# Altium schematic sheet power.SchDoc
size A4; SheetNumber: 4; SheetTotal: 5
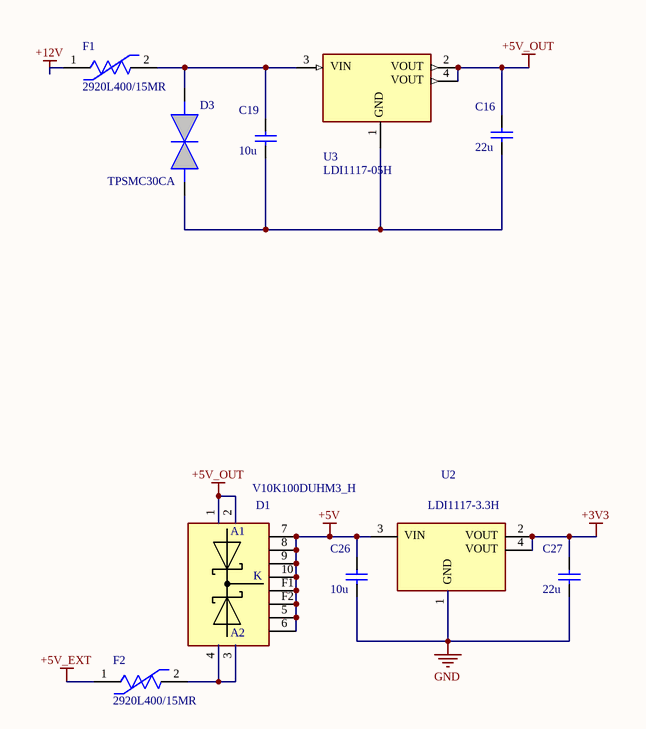
[diagram p0: power.SchDoc]

## Parts
C16  22u  [CAPC1206(3216)150_L]
C19  10u  [CAPC1206(3216)150_L]
C26  10u  [CAPC1206(3216)150_L]
C27  22u  [CAPC1206(3216)150_L]
D1  V10K100DUHM3_H  [V10K100DUHM3H]
D3  TPSMC30CA  [TPSMC30CA]
F1  2920L400/15MR  [FP-2920L400-15MR-MFG]
F2  2920L400/15MR  [FP-2920L400-15MR-MFG]
U2  LDI1117-3.3H  [LDI1117-3.3H]
U3  LDI1117-05H  [LDI1117-05H]

## Nets
+3V3: C27.1 U2.2 U2.4
+5V: C26.1 D1.5 D1.6 D1.7 D1.8 D1.9 D1.10 D1.F1 D1.F2 U2.3
+5V_EXT: F2.1
+5V_OUT: C16.1 D1.1 D1.2 U3.2 U3.4
+12V: F1.1
GND: C26.2 C27.2 U2.1
NetC16_2: C16.2 C19.2 D3.2(A)
NetC19_1: C19.1 D3.1(K) F1.2 U3.3
NetD1_3: D1.3 D1.4 F2.2

Not connected (* = marked no-connect by the designer): U3 1

## Notes on the sheet
- (in symbol LDI1117-3.3H) VIN; VOUT; GND
- (in symbol LDI1117-05H) VIN; VOUT; GND
- (in symbol V10K100DUHM3_H) A1; K; A2

## Library data of the parts
C16 C19 C26 C27 = CMP-1037-04778-1: CAP 1.8uF 10V ±5% 1206 (3216 Metric) Thickness 1.45mm SMD; Case-EIA: 1206; Tolerance: Â±5%; Case-Metric: 3216; Technology: SMT; Value: 1.8uF; Rated Voltage: 10 V; Max Thickness: 1.45 mm
D1 = V10K100DUHM3_H: Schottky Diodes & Rectifiers 10A 100V TMBS FlatPAK 5x6; Manufacturer_Name: Vishay; Manufacturer_Part_Number: V10K100DUHM3/H; Geometry.Height: 1.09mm; Mouser Part Number: 78-V10K100DUHM3/H; Mouser Price/Stock: https://www.mouser.co.uk/ProductDetail/Vishay-General-Semiconductor/V10K100DUHM3-H/?qs=u16ybLDytRayB9owesg4qQ%3D%3D; Arrow Part Number: *; Arrow Price/Stock: *; Datasheet Link: https://www.farnell.com/datasheets/2721061.pdf
D3 = TPSMC30CA: TPSMC Series - Surface Mount, 1500W TVS Diode-AEC-Q101 Qualified, 25.6V, 41.4V, DO-214AB, RoHS; Manufacturer_Name: Vishay; Manufacturer_Part_Number: VS-MBRS340-M3/9AT; Manufacturer: Littelfuse; Geometry.Height: 2.62mm; Breakdown Voltage: 30V; Max Breakdown Voltage: 31.5V; Max Power Dissipation: 6.5W; Max Reverse Leakage Current: 1µA; Max Surge Current: 36.7A; Min Breakdown Voltage: 28.5V; Number of Bidirectional Channels: 1; Peak Pulse Power: 1.5kW; Polarity: Bidirectional; Power Line Protection: No; Test Current: 1mA; Working Voltage: 3.5V; Mouser Part Number: 78-VS-MBRS340-M39AT; Mouser Price/Stock: https://www.mouser.co.uk/ProductDetail/Vishay-Semiconductors/VS-MBRS340-M3-9AT?qs=nc3S1USEIbv1XISTKnRMKw%3D%3D; Arrow Part Number: VS-MBRS340-M3/9AT; Arrow Price/Stock: https://www.arrow.com/en/products/vs-mbrs340-m39at/vishay?region=nac; Datasheet Link: https://componentsearchengine.com/Datasheets/1/VS-MBRS340-M3_9AT.pdf; Supplier: Farnell; Supplier Part Number: 3392487; Manufacturer Part Number: TPSMC30CA; RoHS: Compliant; Category: TVS Diodes; Stock: 2290; Clamping Voltage: 41.4V; Composition: Zener; Height: 2.62mm; Lead Free: Lead Free; Length: 7.11mm; Lifecycle Status: Production; Max Operating Temperature: 150°C; Min Operating Temperature: -65°C; Mounting Technology: Surface Mount; Number of Elements: 1; Number of Terminals: 2; Packaging: Digi-Reel®; Peak Pulse Current: 36.7A; Peak Reverse Current: 1µA; REACH SVHC: No; Reverse Standoff Voltage: 25.6V; Reverse Voltage: 25.6V; Schedule B: 8541100080; Termination: SMD/SMT; Weight: 210.013267mg; Width: 6.22mm; ComponentLink1URL: https://datasheet.octopart.com:443/TPSMC30CA-Littelfuse-datasheet-180609796.pdf?src-supplier=IHS; ComponentLink1Description: https://datasheet.octopart.com:443/TPSMC30CA-Littelfuse-datasheet-180609796.pdf?src-supplier=IHS; ComponentLink2URL: https://datasheet.octopart.com:443/TPSMC30CA-Littelfuse-datasheet-140259240.pdf?src-supplier=Newark; ComponentLink2Description: https://datasheet.octopart.com:443/TPSMC30CA-Littelfuse-datasheet-140259240.pdf?src-supplier=Newark; ComponentLink3URL: https://datasheet.octopart.com:443/TPSMC30CA-Littelfuse-datasheet-104627261.pdf?src-supplier=Littelfuse+SCT; ComponentLink3Description: https://datasheet.octopart.com:443/TPSMC30CA-Littelfuse-datasheet-104627261.pdf?src-supplier=Littelfuse+SCT; ComponentLink4URL: https://datasheet.octopart.com:443/TPSMC30CA-Littelfuse-datasheet-36859614.pdf?src-supplier=Fuses+Unlimited; ComponentLink4Description: https://datasheet.octopart.com:443/TPSMC30CA-Littelfuse-datasheet-36859614.pdf?src-supplier=Fuses+Unlimited; ComponentLink5URL: https://datasheet.octopart.com:443/TPSMC30CA-Littelfuse-datasheet-178249297.pdf?src-supplier=Burklin+Elektronik; ComponentLink5Description: https://datasheet.octopart.com:443/TPSMC30CA-Littelfuse-datasheet-178249297.pdf?src-supplier=Burklin+Elektronik
F1 F2 = CMP-08606-000010-2: PTC RESET FUSE 15V 4A 2920; Max Current Rating: 40A; Time to Trip: 4s; Trip Current: 8A; Approvals: TUV; Min Operating Temperature: -40°C; Packaging: Tape and Reel; Case Code (Metric): 7351; Hold Current: 4A; Max Operating Temperature: 85°C; Case Code (Imperial): 2920; Mount: Surface Mount
U2 = LDI1117-3.3H: Fixed Positive LDO Regulator; Manufacturer: Diotec; Supplier: Mouser; Supplier Part Number: 637-LDI1117-3.3H; Manufacturer Part Number: LDI1117-3.3H; RoHS: No; Category: Voltage Regulators - Linear; Stock: 5056; Pricing: 1=0,4, 10=0,286, 50=0,286, 100=0,199, 1000=0,163, 10000=0,089 (USD); ComponentLink1URL: https://datasheet.octopart.com/LDI1117-3.3H-Diotec-datasheet-154607892.pdf?src-supplier=TME; ComponentLink1Description: https://datasheet.octopart.com/LDI1117-3.3H-Diotec-datasheet-154607892.pdf?src-supplier=TME; ComponentLink2URL: https://datasheet.octopart.com/LDI1117-3.3H-Diotec-datasheet-159101088.pdf?src-supplier=SOS+electronic; ComponentLink2Description: https://datasheet.octopart.com/LDI1117-3.3H-Diotec-datasheet-159101088.pdf?src-supplier=SOS+electronic; ComponentLink3URL: https://datasheet.octopart.com/LDI1117-3.3H-Diotec-datasheet-189099648.pdf?src-supplier=Master+Electronics; ComponentLink3Description: https://datasheet.octopart.com/LDI1117-3.3H-Diotec-datasheet-189099648.pdf?src-supplier=Master+Electronics
U3 = LDI1117-05H: Fixed Positive LDO Regulator; Manufacturer: Diotec; Supplier: Farnell; Supplier Part Number: 4553249; Manufacturer Part Number: LDI1117-05H; RoHS: No; Category: Voltage Regulators - Linear; Stock: 720; RoHS Compliant: Yes; ComponentLink1URL: http://datasheet.octopart.com/LDI1117-05H-Diotec-datasheet-154607892.pdf?src-supplier=Mouser; ComponentLink1Description: http://datasheet.octopart.com/LDI1117-05H-Diotec-datasheet-154607892.pdf?src-supplier=Mouser; ComponentLink2URL: http://datasheet.octopart.com/LDI1117-05H-Diotec-datasheet-154607892.pdf?src-supplier=Distrelec; ComponentLink2Description: http://datasheet.octopart.com/LDI1117-05H-Diotec-datasheet-154607892.pdf?src-supplier=Distrelec; ComponentLink3URL: http://datasheet.octopart.com/LDI1117-05H-Diotec-datasheet-154607892.pdf?src-supplier=Onlinecomponents.com; ComponentLink3Description: http://datasheet.octopart.com/LDI1117-05H-Diotec-datasheet-154607892.pdf?src-supplier=Onlinecomponents.com; ComponentLink4URL: http://datasheet.octopart.com/LDI1117-05H-Diotec-datasheet-154607892.pdf?src-supplier=DComponents; ComponentLink4Description: http://datasheet.octopart.com/LDI1117-05H-Diotec-datasheet-154607892.pdf?src-supplier=DComponents; ComponentLink5URL: https://datasheet.octopart.com/LDI1117-05H-Diotec-datasheet-154607892.pdf?src-supplier=TME; ComponentLink5Description: https://datasheet.octopart.com/LDI1117-05H-Diotec-datasheet-154607892.pdf?src-supplier=TME; ComponentLink6URL: https://datasheet.octopart.com/LDI1117-05H-Diotec-datasheet-159101088.pdf?src-supplier=SOS+electronic; ComponentLink6Description: https://datasheet.octopart.com/LDI1117-05H-Diotec-datasheet-159101088.pdf?src-supplier=SOS+electronic; ComponentLink7URL: http://datasheet.octopart.com/LDI1117-05H-Diotec-datasheet-154607892.pdf?src-supplier=Electro+Sonic; ComponentLink7Description: http://datasheet.octopart.com/LDI1117-05H-Diotec-datasheet-154607892.pdf?src-supplier=Electro+Sonic; ComponentLink8URL: https://datasheet.octopart.com/LDI1117-05H-Diotec-datasheet-189099648.pdf?src-supplier=Master+Electronics; ComponentLink8Description: https://datasheet.octopart.com/LDI1117-05H-Diotec-datasheet-189099648.pdf?src-supplier=Master+Electronics